# Altium schematic sheet HDMI-OUT.SchDoc: HDMI PORT-OUT
size A4; Revision: V1.0; SheetNumber: 4; SheetTotal: 5; DOC_NO_SCH_DWG: #012022051403
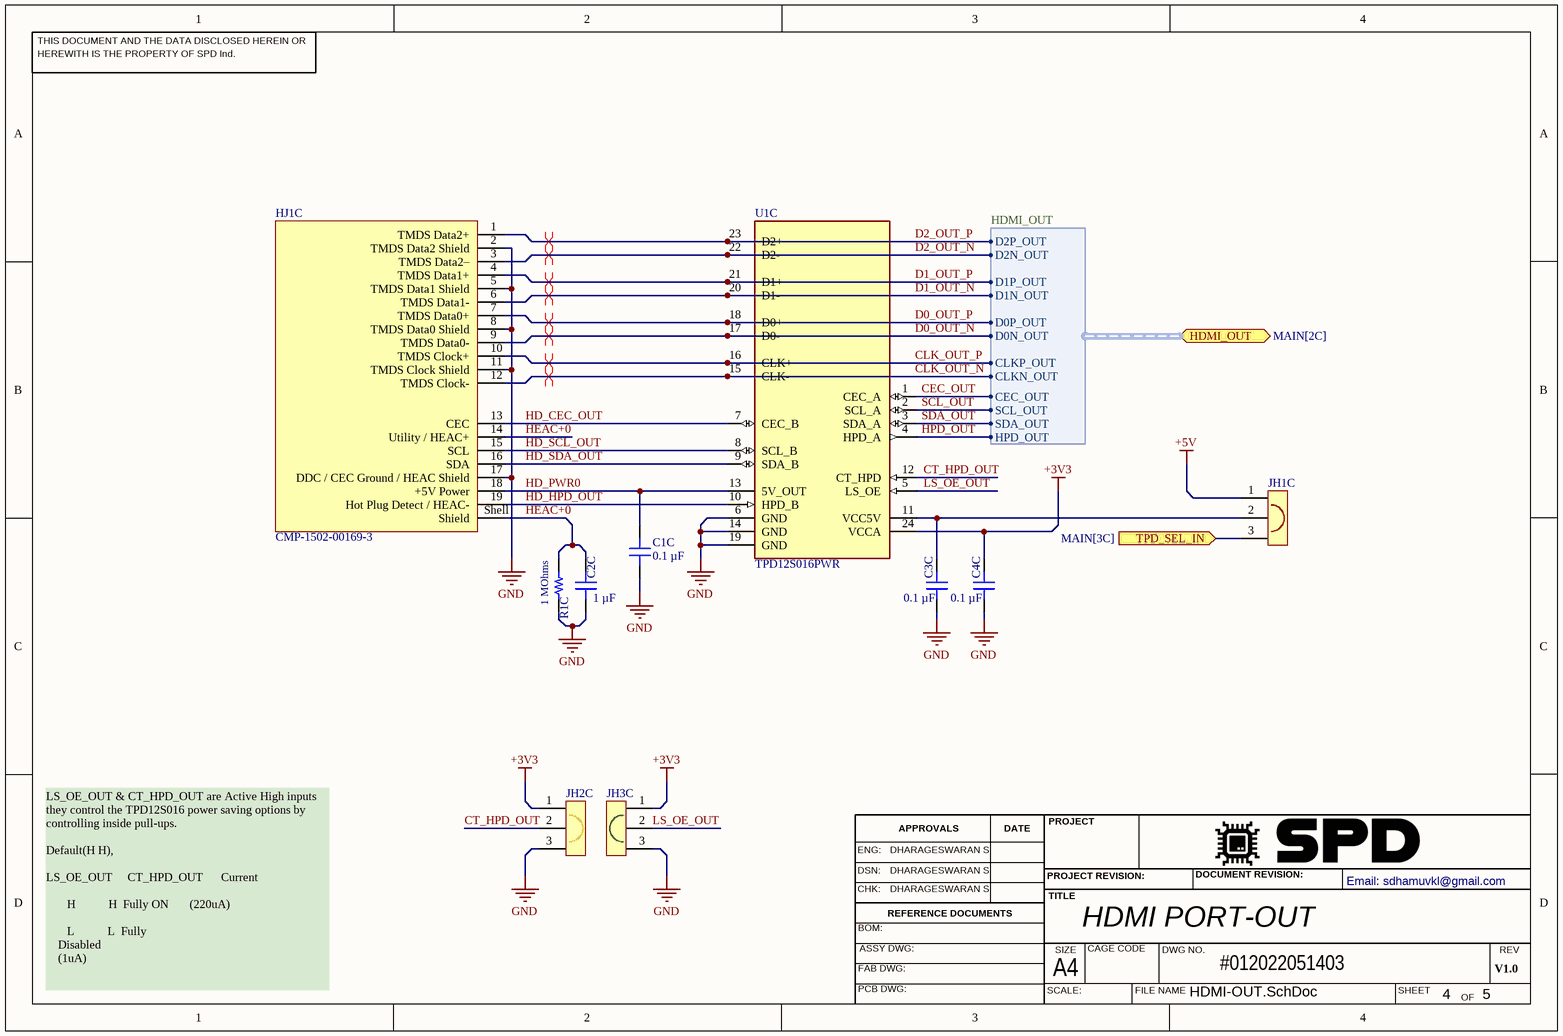
[diagram p0: HDMI-OUT.SchDoc]

## Parts
C1C  0.1 µF  [CAP 0603_1608]
C2C  1 µF  [CAP 0603_1608]
C3C  0.1 µF  [CAP 0603_1608]
C4C  0.1 µF  [CAP 0603_1608]
HJ1C  CMP-1502-00169-3  [HDMI]
JH1C  3PIN-JUMPER-RED  [JUMPER-3PIN-RED]  (value not drawn)
JH2C  3PIN-JUMPER-YELLOW  [JUMPER-3PIN-YELLOW]  (value not drawn)
JH3C  3PIN-JUMPER-GREEN  [JUMPER-3PIN-GREEN]  (value not drawn)
R1C  1 MOhms  [RES 0603_1608]
U1C  TPD12S016PWR  [PW0024A_N]

## Ports
HDMI_OUT (bidir, harness HDMI_OUT, see MAIN[2C]), TPD_SEL_IN (in, see MAIN[3C])

## Harnesses
HDMI_OUT: D2P_OUT, D2N_OUT, D1P_OUT, D1N_OUT, D0P_OUT, D0N_OUT, CLKP_OUT, CLKN_OUT, CEC_OUT, SCL_OUT, SDA_OUT, HPD_OUT

## Nets
+3V3: C4C.2 JH2C.1 JH3C.1 U1C.24(VCCA)
+5V: JH1C.1
GND: C1C.1 C2C.1 C3C.1 C4C.1 HJ1C.2(TMDS_Data2_Shield) HJ1C.5(TMDS_Data1_Shield) HJ1C.8(TMDS_Data0_Shield) HJ1C.11(TMDS_Clock_Shield) HJ1C.17(DDC_/_CEC_Ground_/_HEAC_Shield) JH2C.3 JH3C.3 R1C.1 U1C.6(GND) U1C.14(GND) U1C.19(GND)
CEC_OUT: U1C.1(CEC_A) ; port HDMI_OUT.CEC_OUT
CLK_OUT_N: HJ1C.12(TMDS_Clock-) U1C.15(CLK-) ; port HDMI_OUT.CLKN_OUT
CLK_OUT_P: HJ1C.10(TMDS_Clock+) U1C.16(CLK+) ; port HDMI_OUT.CLKP_OUT
CT_HPD_OUT: JH2C.2 U1C.12(CT_HPD)
D0_OUT_N: HJ1C.9(TMDS_Data0-) U1C.17(D0-) ; port HDMI_OUT.D0N_OUT
D0_OUT_P: HJ1C.7(TMDS_Data0+) U1C.18(D0+) ; port HDMI_OUT.D0P_OUT
D1_OUT_N: HJ1C.6(TMDS_Data1-) U1C.20(D1-) ; port HDMI_OUT.D1N_OUT
D1_OUT_P: HJ1C.4(TMDS_Data1+) U1C.21(D1+) ; port HDMI_OUT.D1P_OUT
D2_OUT_N: HJ1C.3(TMDS_Data2–) U1C.22(D2-) ; port HDMI_OUT.D2N_OUT
D2_OUT_P: HJ1C.1(TMDS_Data2+) U1C.23(D2+) ; port HDMI_OUT.D2P_OUT
HD_CEC_OUT: HJ1C.13(CEC) U1C.7(CEC_B)
HD_HPD_OUT: HJ1C.19(Hot_Plug_Detect_/_HEAC-) U1C.10(HPD_B)
HD_PWR0: C1C.2 HJ1C.18(+5V_Power) U1C.13(5V_OUT)
HD_SCL_OUT: HJ1C.15(SCL) U1C.8(SCL_B)
HD_SDA_OUT: HJ1C.16(SDA) U1C.9(SDA_B)
HEAC+0: C2C.2 HJ1C.14(Utility_/_HEAC+) HJ1C.Shell(Shield) R1C.2
HPD_OUT: U1C.4(HPD_A) ; port HDMI_OUT.HPD_OUT
LS_OE_OUT: JH3C.2 U1C.5(LS_OE)
SCL_OUT: U1C.2(SCL_A) ; port HDMI_OUT.SCL_OUT
SDA_OUT: U1C.3(SDA_A) ; port HDMI_OUT.SDA_OUT
TPD_SEL_IN: JH1C.3 ; port TPD_SEL_IN
NetC3C_2: C3C.2 JH1C.2 U1C.11(VCC5V)

## Layout directives
differential pair: CLK_OUT_N, CLK_OUT_P, D0_OUT_N, D0_OUT_P, D1_OUT_N, D1_OUT_P, D2_OUT_N, D2_OUT_P

## Notes on the sheet
- LS_OE_OUT & CT_HPD_OUT are Active High inputs they control the TPD12S016 power saving options by controlling inside pull-ups.
  Default(H H),
  LS_OE_OUT	    CT_HPD_OUT      Current
  H		         H		Fully ON 						(220uA)
  L		         L		Fully
  Disabled
  (1uA)
- THIS DOCUMENT AND THE DATA DISCLOSED HEREIN OR
- HEREWITH IS THE PROPERTY OF SPD Ind.
- ENG:
- DHARAGESWARAN S
- APPROVALS
- DATE
- PROJECT
- DSN:
- CHK:
- REFERENCE DOCUMENTS
- PROJECT REVISION:
- TITLE
- DOCUMENT REVISION:
- Email: sdhamuvkl@gmail.com <https://github.com/DhamuVkl>
- BOM:
- FAB DWG:
- PCB DWG:
- ASSY DWG:
- SCALE:
- A4
- SIZE
- CAGE CODE
- FILE NAME
- DWG NO.
- SHEET
- REV
- OF

## Library data of the parts
C1C C3C C4C = CC0603KRX7R6BB104: CAP CER 0.1UF 10V X7R 0603; Manufacturer: Yageo; id: 1361; Tolerance: ±10%; Part Number: CC0603KRX7R6BB104; Value: 0.1 µF; Temperature Coefficient: X7R; Supplier Part Number 1: 311-4055-1-ND; ComponentLink2Description: DigiKey Link; ComponentLink1URL: https://www.yageo.com/upload/media/product/productsearch/datasheet/mlcc/UPY-GPHC_X7R_6.3V-to-50V_18.pdf; PartId: 7937; Supplier 1: DigiKey; Series: CC; LastUpdated: 2023-01-03T20:07:31.763; Part Status: Active; Capacitance: 0.1 µF; Device Package: 0603 (1608 Metric); Thickness (Max): 0.035" (0.90mm); Voltage - Rated: 10V; Minimum Order: 1; Packaging: TapeAndReel; Applications: General Purpose; Package / Case: 0603 (1608 Metric); ComponentLink1Description: Datasheet; Price: 0.01; ComponentLink2URL: https://www.digikey.com/en/products/detail/yageo/CC0603KRX7R6BB104/5883741; Lifecycle Status: Active; Operating Temperature: -55°C ~ 125°C; Size / Dimension: 0.063" L x 0.031" W (1.60mm x 0.80mm); Mounting Type: Surface Mount, MLCC
C2C = CC0603ZRY5V6BB105: CAP CER 1UF 10V Y5V 0603; Manufacturer: Yageo; id: 740; Temperature Coefficient: Y5V (F); Tolerance: -20%, +80%; Part Number: CC0603ZRY5V6BB105; Value: 1 µF; Supplier Part Number 1: 311-1357-1-ND; ComponentLink2Description: DigiKey Link; ComponentLink1URL: http://www.yageo.com/documents/recent/UPY-GPHC_Y5V_6.3V-to-50V_8.pdf; PartId: 5197; Supplier 1: DigiKey; Series: CC; LastUpdated: 2023-01-03T20:07:40.253; Part Status: Active; Capacitance: 1 µF; Device Package: 0603 (1608 Metric); Thickness (Max): 0.035" (0.90mm); Voltage - Rated: 10V; Minimum Order: 1; Packaging: TapeAndReel; Applications: General Purpose; Package / Case: 0603 (1608 Metric); ComponentLink1Description: Datasheet; Price: 0.01; ComponentLink2URL: https://www.digikey.com/en/products/detail/yageo/CC0603ZRY5V6BB105/2103095; Lifecycle Status: Active; Operating Temperature: -30°C ~ 85°C; Size / Dimension: 0.063" L x 0.031" W (1.60mm x 0.80mm); Mounting Type: Surface Mount, MLCC
R1C = ERJ-U03J105V: RES 1 M OHM 5% 1/10W 0603 SMD; Manufacturer: Panasonic Electronic Components; id: 14889; Temperature Coefficient: -400/ +150ppm/°C; Power (Watts): 0.1W, 1/10W; Part Number: ERJ-U03J105V; Height - Seated (Max): 0.022" (0.55mm); Supplier Part Number 1: 10-ERJ-U03J105VCT-ND; Supplier Device Package: 0603; ComponentLink1Description: Datasheet; ComponentLink2URL: https://www.digikey.com/en/products/detail/panasonic-electronic-components/ERJ-U03J105V/11636001; Features: Anti-Sulfur, Automotive AEC-Q200; ComponentLink1URL: https://industrial.panasonic.com/cdbs/www-data/pdf/RDP0000/AOA0000C334.pdf; Composition: Thick Film; Tolerance: ±5%; Supplier 1: DigiKey; Series: ERJ-U03; Part Status: Active; ComponentLink2Description: DigiKey Link; Device Package: 0603 (1608 Metric); Packaging: TapeAndReel; Ratings: AEC-Q200; Minimum Order: 1; Package / Case: 0603 (1608 Metric); PartId: 63423; Lifecycle Status: Active; LastUpdated: 2023-01-02T20:28:16.920; Operating Temperature: -55°C ~ 155°C; Number Of Terminations: 2; Value: 1 MOhms; Size / Dimension: 0.063" L x 0.031" W (1.60mm x 0.80mm); Price: 0.01; Resistance: 1 MOhms
U1C = CMP-0326-00070-3: Value-Line HDMI Companion Chip for Portable Applications, 12 Channels, -40 to +85 degC, 24-pin TSSOP (PW), Green (RoHS & no Sb/Br); Manufacturer: Texas Instruments; Differential Capacitance(pF): 0.05; IEC 61000-4-2 Contact(+/- kV): 8; SubFamily: ESD Solution; Breakdown Voltage(Min)(V): 9; IO Capacitance(Typ)(pF): 1; IO Leakage Current(nA): 1000; ComponentLink3Description: URL Link1; PackageReference: PW0024A; PackageDescription: 24-Pin Thin Small Outline Package 0.65 mm Pitch; PartNumber: TPD12S016PWR; ComponentLink3URL: SamplesURL:http://www.ti.com/product/tpd12s016#samples; ComponentLink2Description: Datasheet; ComponentLink2URL: http://www.ti.com/general/docs/lit/getliterature.tsp?genericPartNumber=TPD12S016&fileType=pdf; ComponentLink1Description: Manufacturer URL; ComponentLink1URL: http://www.ti.com/; Eco-Plan: Green (RoHS & no Sb/Br); Mounting Technology: Surface Mount; DatasheetVersion: SLLSE96A; PackageVersion: revG, Feb-2011
HJ1C = CMP-1502-00169-3: Supplier 1: Mouser; Supplier Part Number 1: 538-208658-1051; Supplier 2: Mouser; Supplier Part Number 2: 710-685119134923